# Altium schematic sheet CPU PHY.SchDoc: CPU PHY
size A2; DrawnBy: UKAYACIK; Engineer: UKAYACIK; DocumentNumber: 5; Revision: B; SheetNumber: 6; SheetTotal: 21
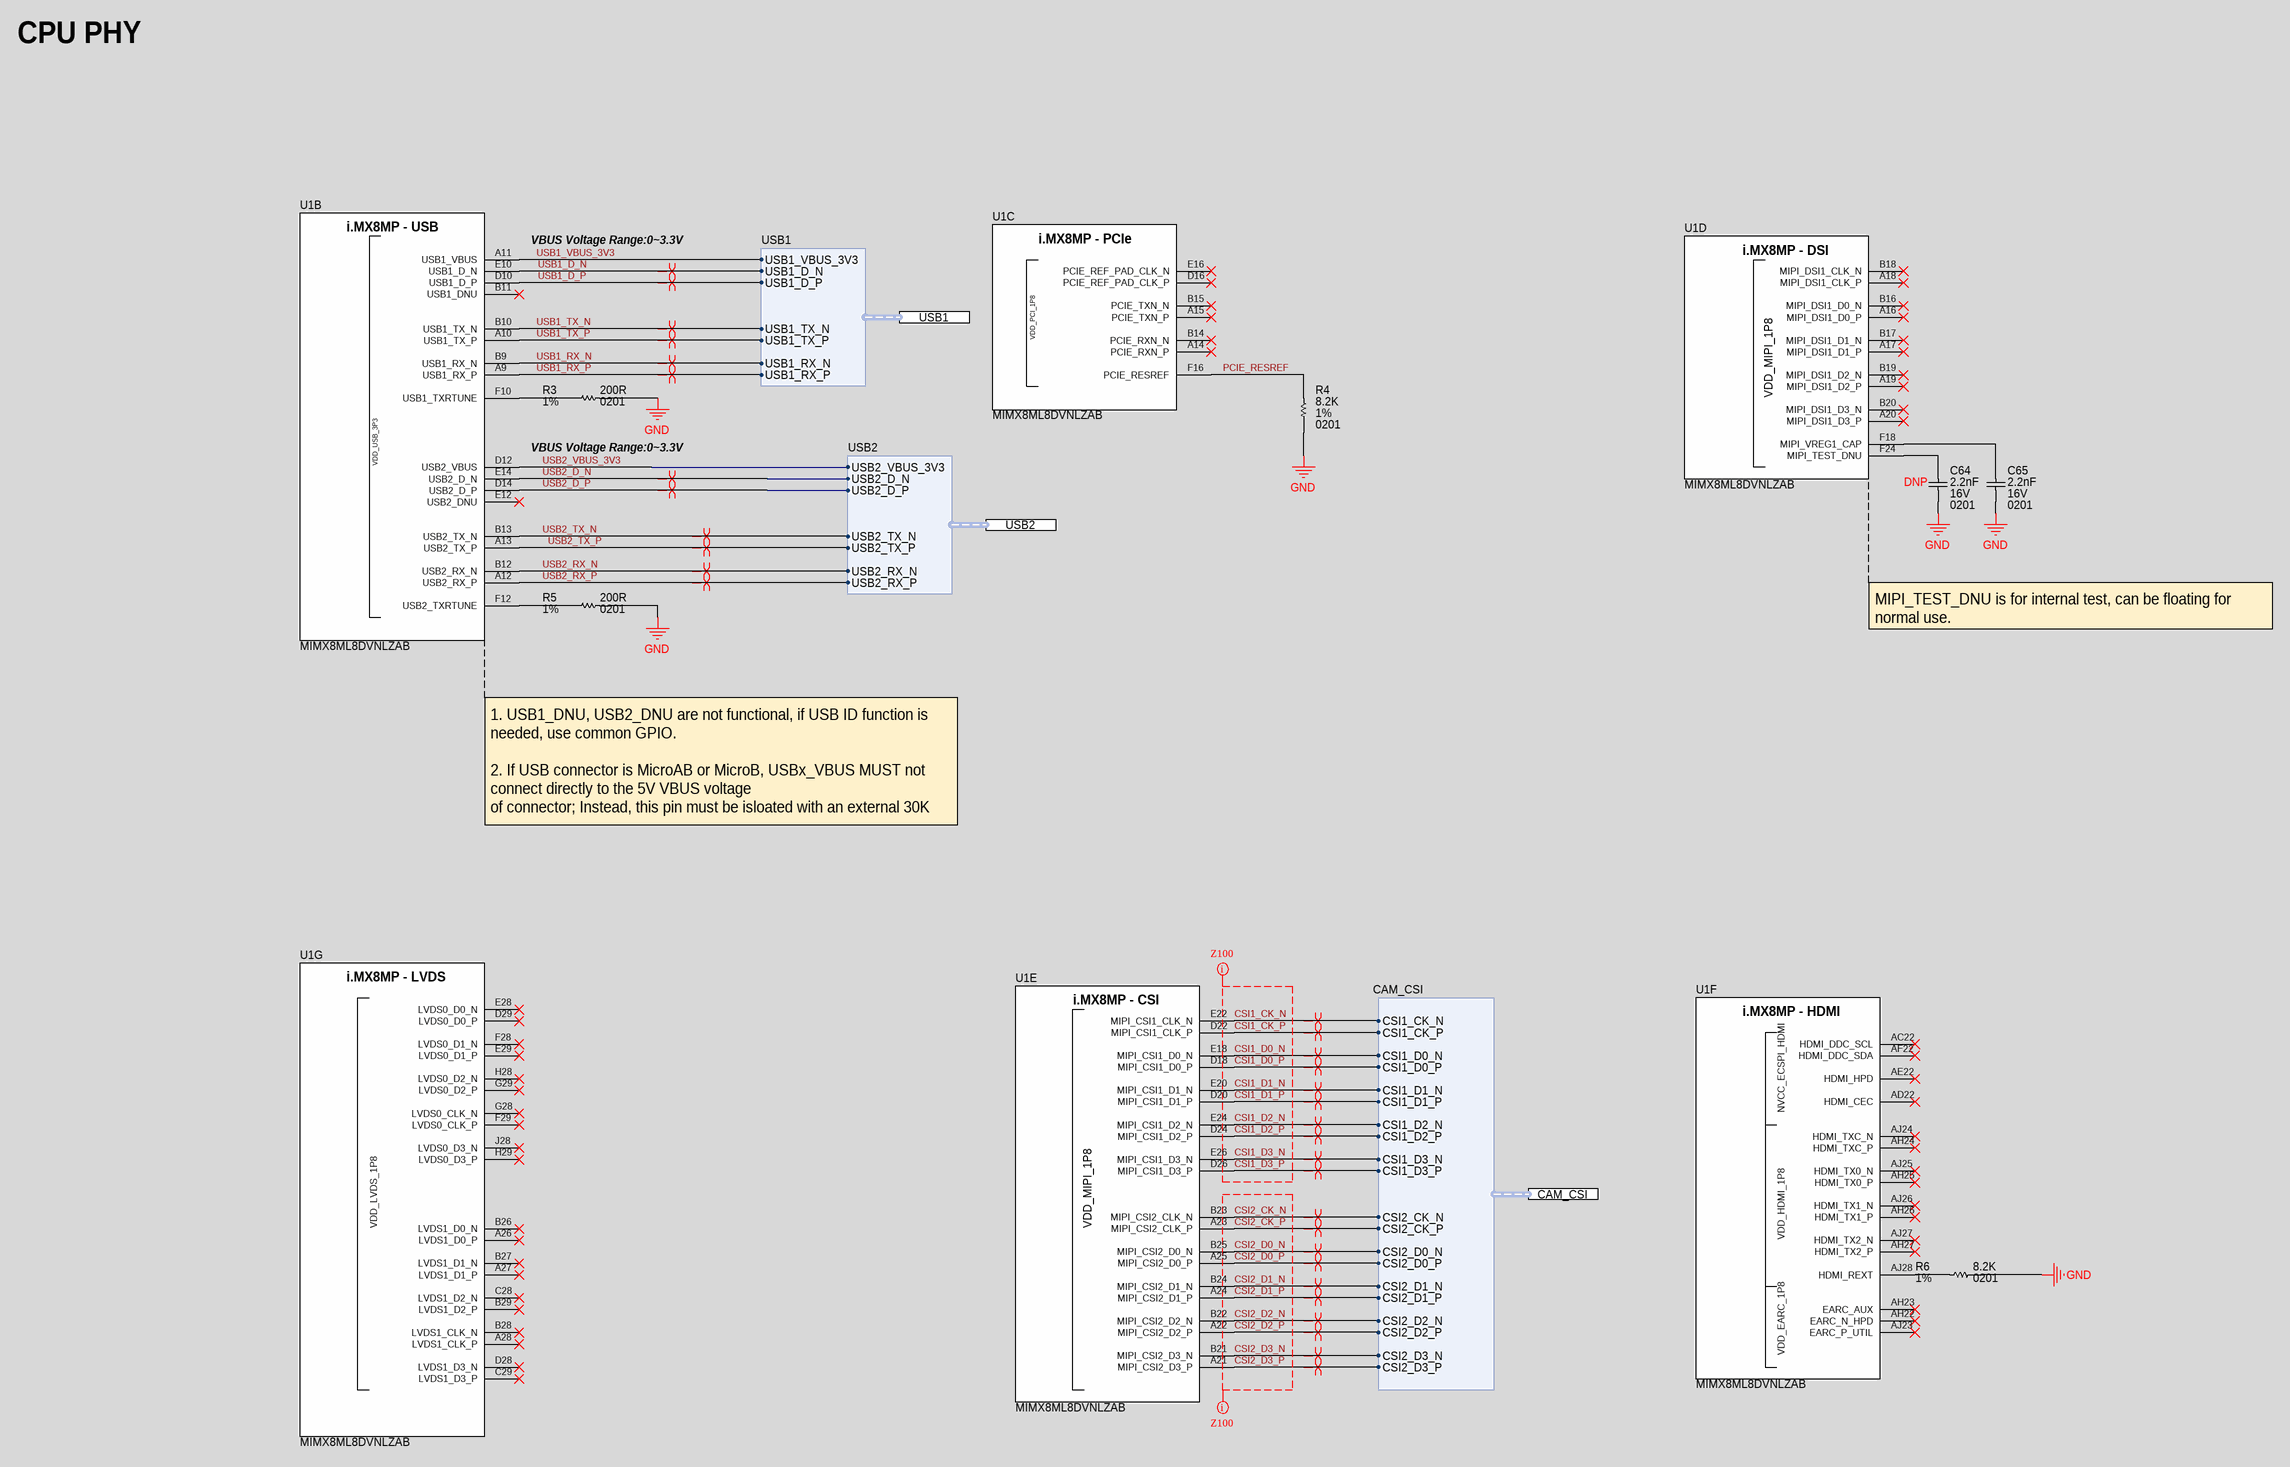
[diagram p0: CPU PHY.SchDoc]

## Parts
C64  Voltage Rating: 16V  Capacitance: 2.2nF  Case/Package: 0201  [CAP_0201_CAPC0603X03N]  (hidden comment: GRM033R71C222KA88D)
C65  Voltage Rating: 16V  Capacitance: 2.2nF  Case/Package: 0201  [CAP_0201_CAPC0603X03N]  (hidden comment: GRM033R71C222KA88D)
R3  Tolerance: 1%  Resistance: 200R  Case/Package: 0201  [RES_0201_RESC0603X02N]  (hidden comment: RC0201FR-07200RL)
R4  Tolerance: 1%  Resistance: 8.2K  Case/Package: 0201  [RES_0201_RESC0603X02N]  (hidden comment: RC0201FR-078K2L)
R5  Tolerance: 1%  Resistance: 200R  Case/Package: 0201  [RES_0201_RESC0603X02N]  (hidden comment: RC0201FR-07200RL)
R6  Tolerance: 1%  Resistance: 8.2K  Case/Package: 0201  [RES_0201_RESC0603X02N]  (hidden comment: RC0201FR-078K2L)
U1  MIMX8ML8DVNLZAB  [IC_MPU_BGA548C50P29X29_1500X1500X148]  (parts B,C,D,E,F,G of 15)

## Ports
CAM_CSI (harness CAM_CSI), USB1 (harness USB1), USB2 (harness USB2)

## Harnesses
USB1: USB1_VBUS_3V3, USB1_D_N, USB1_D_P, USB1_TX_N, USB1_TX_P, USB1_RX_N, USB1_RX_P
CAM_CSI: CSI1_CK_N, CSI1_CK_P, CSI1_D0_N, CSI1_D0_P, CSI1_D1_N, CSI1_D1_P, CSI1_D2_N, CSI1_D2_P, CSI1_D3_N, CSI1_D3_P, CSI2_CK_N, CSI2_CK_P, CSI2_D0_N, CSI2_D0_P, CSI2_D1_N, CSI2_D1_P, CSI2_D2_N, CSI2_D2_P, CSI2_D3_N, CSI2_D3_P
USB2: USB2_VBUS_3V3, USB2_TX_N, USB2_TX_P, USB2_RX_N, USB2_RX_P, USB2_D_N, USB2_D_P

## Nets
GND: C64.1 C65.1 R3.2 R4.1 R5.2 R6.1
CSI1_CK_N: U1.E22(MIPI_CSI1_CLK_N) ; port CAM_CSI.CSI1_CK_N
CSI1_CK_P: U1.D22(MIPI_CSI1_CLK_P) ; port CAM_CSI.CSI1_CK_P
CSI1_D0_N: U1.E18(MIPI_CSI1_D0_N) ; port CAM_CSI.CSI1_D0_N
CSI1_D0_P: U1.D18(MIPI_CSI1_D0_P) ; port CAM_CSI.CSI1_D0_P
CSI1_D1_N: U1.E20(MIPI_CSI1_D1_N) ; port CAM_CSI.CSI1_D1_N
CSI1_D1_P: U1.D20(MIPI_CSI1_D1_P) ; port CAM_CSI.CSI1_D1_P
CSI1_D2_N: U1.E24(MIPI_CSI1_D2_N) ; port CAM_CSI.CSI1_D2_N
CSI1_D2_P: U1.D24(MIPI_CSI1_D2_P) ; port CAM_CSI.CSI1_D2_P
CSI1_D3_N: U1.E26(MIPI_CSI1_D3_N) ; port CAM_CSI.CSI1_D3_N
CSI1_D3_P: U1.D26(MIPI_CSI1_D3_P) ; port CAM_CSI.CSI1_D3_P
CSI2_CK_N: U1.B23(MIPI_CSI2_CLK_N) ; port CAM_CSI.CSI2_CK_N
CSI2_CK_P: U1.A23(MIPI_CSI2_CLK_P) ; port CAM_CSI.CSI2_CK_P
CSI2_D0_N: U1.B25(MIPI_CSI2_D0_N) ; port CAM_CSI.CSI2_D0_N
CSI2_D0_P: U1.A25(MIPI_CSI2_D0_P) ; port CAM_CSI.CSI2_D0_P
CSI2_D1_N: U1.B24(MIPI_CSI2_D1_N) ; port CAM_CSI.CSI2_D1_N
CSI2_D1_P: U1.A24(MIPI_CSI2_D1_P) ; port CAM_CSI.CSI2_D1_P
CSI2_D2_N: U1.B22(MIPI_CSI2_D2_N) ; port CAM_CSI.CSI2_D2_N
CSI2_D2_P: U1.A22(MIPI_CSI2_D2_P) ; port CAM_CSI.CSI2_D2_P
CSI2_D3_N: U1.B21(MIPI_CSI2_D3_N) ; port CAM_CSI.CSI2_D3_N
CSI2_D3_P: U1.A21(MIPI_CSI2_D3_P) ; port CAM_CSI.CSI2_D3_P
PCIE_RESREF: R4.2 U1.F16(PCIE_RESREF)
USB1_D_N: U1.E10(USB1_D_N) ; port USB1.USB1_D_N
USB1_D_P: U1.D10(USB1_D_P) ; port USB1.USB1_D_P
USB1_RX_N: U1.B9(USB1_RX_N) ; port USB1.USB1_RX_N
USB1_RX_P: U1.A9(USB1_RX_P) ; port USB1.USB1_RX_P
USB1_TX_N: U1.B10(USB1_TX_N) ; port USB1.USB1_TX_N
USB1_TX_P: U1.A10(USB1_TX_P) ; port USB1.USB1_TX_P
USB1_VBUS_3V3: U1.A11(USB1_VBUS) ; port USB1.USB1_VBUS_3V3
USB2_D_N: U1.E14(USB2_D_N) ; port USB2.USB2_D_N
USB2_D_P: U1.D14(USB2_D_P) ; port USB2.USB2_D_P
USB2_RX_N: U1.B12(USB2_RX_N) ; port USB2.USB2_RX_N
USB2_RX_P: U1.A12(USB2_RX_P) ; port USB2.USB2_RX_P
USB2_TX_N: U1.B13(USB2_TX_N) ; port USB2.USB2_TX_N
USB2_TX_P: U1.A13(USB2_TX_P) ; port USB2.USB2_TX_P
USB2_VBUS_3V3: U1.D12(USB2_VBUS) ; port USB2.USB2_VBUS_3V3
NetC64_2: C64.2 U1.F24(MIPI_TEST_DNU)
NetC65_2: C65.2 U1.F18(MIPI_VREG1_CAP)
NetR3_1: R3.1 U1.F10(USB1_TXRTUNE)
NetR5_1: R5.1 U1.F12(USB2_TXRTUNE)
NetR6_2: R6.2 U1.AJ28(HDMI_REXT)

Not connected (* = marked no-connect by the designer): U1 A14(PCIE_RXN_P)* A15(PCIE_TXN_P)* A16(MIPI_DSI1_D0_P)* A17(MIPI_DSI1_D1_P)* A18(MIPI_DSI1_CLK_P)* A19(MIPI_DSI1_D2_P)* A20(MIPI_DSI1_D3_P)* A26(LVDS1_D0_P)* A27(LVDS1_D1_P)* A28(LVDS1_CLK_P)* AC22(HDMI_DDC_SCL)* AD22(HDMI_CEC)* AE22(HDMI_HPD)* AF22(HDMI_DDC_SDA)* AH22(EARC_N_HPD)* AH23(EARC_AUX)* AH24(HDMI_TXC_P)* AH25(HDMI_TX0_P)* AH26(HDMI_TX1_P)* AH27(HDMI_TX2_P)* AJ23(EARC_P_UTIL)* AJ24(HDMI_TXC_N)* AJ25(HDMI_TX0_N)* AJ26(HDMI_TX1_N)* AJ27(HDMI_TX2_N)* B11(USB1_DNU)* B14(PCIE_RXN_N)* B15(PCIE_TXN_N)* B16(MIPI_DSI1_D0_N)* B17(MIPI_DSI1_D1_N)* B18(MIPI_DSI1_CLK_N)* B19(MIPI_DSI1_D2_N)* B20(MIPI_DSI1_D3_N)* B26(LVDS1_D0_N)* B27(LVDS1_D1_N)* B28(LVDS1_CLK_N)* B29(LVDS1_D2_P)* C28(LVDS1_D2_N)* C29(LVDS1_D3_P)* D16(PCIE_REF_PAD_CLK_P)* D28(LVDS1_D3_N)* D29(LVDS0_D0_P)* E12(USB2_DNU)* E16(PCIE_REF_PAD_CLK_N)* E28(LVDS0_D0_N)* E29(LVDS0_D1_P)* F28(LVDS0_D1_N)* F29(LVDS0_CLK_P)* G28(LVDS0_CLK_N)* G29(LVDS0_D2_P)* H28(LVDS0_D2_N)* H29(LVDS0_D3_P)* J28(LVDS0_D3_N)*

## Layout directives
net class CSI1_Z100: CSI1_CK_N, CSI1_CK_P, CSI1_D0_N, CSI1_D0_P, CSI1_D1_N, CSI1_D1_P, CSI1_D2_N, CSI1_D2_P, CSI1_D3_N, CSI1_D3_P
net class CSI2_Z100: CSI2_CK_N, CSI2_CK_P, CSI2_D0_N, CSI2_D0_P, CSI2_D1_N, CSI2_D1_P, CSI2_D2_N, CSI2_D2_P, CSI2_D3_N, CSI2_D3_P
differential pair; differential pair class Z100: CSI1_CK_N, CSI1_CK_P, CSI1_D0_N, CSI1_D0_P, CSI1_D1_N, CSI1_D1_P, CSI1_D2_N, CSI1_D2_P, CSI1_D3_N, CSI1_D3_P, CSI2_CK_N, CSI2_CK_P, CSI2_D0_N, CSI2_D0_P, CSI2_D1_N, CSI2_D1_P, CSI2_D2_N, CSI2_D2_P, CSI2_D3_N, CSI2_D3_P
differential pair; differential pair class Z90: USB1_D_N, USB1_D_P, USB1_RX_N, USB1_RX_P, USB1_TX_N, USB1_TX_P, USB2_D_N, USB2_D_P, USB2_RX_N, USB2_RX_P, USB2_TX_N, USB2_TX_P

## Notes on the sheet
- CPU PHY
- VBUS Voltage Range:0~3.3V
- (near C64) DNP
- MIPI_TEST_DNU is for internal test, can be floating for normal use.
- 1. USB1_DNU, USB2_DNU are not functional, if USB ID function is needed, use common GPIO.
  2. If USB connector is MicroAB or MicroB, USBx_VBUS MUST not connect directly to the 5V VBUS voltage
  of connector; Instead, this pin must be isloated with an external 30K 1% resistor.
- PCB Des :
- Approv By :
- Project Title :
- Sheet Title :
- Date :
- Page :
- PCB Version :
- PCB Revision :
- Size :
- A2
- (in symbol IC_MPU_8M_PLUS_MIMX8ML8DVNLZAB, part B) i.MX8MP - USB
- (in symbol IC_MPU_8M_PLUS_MIMX8ML8DVNLZAB, part C) i.MX8MP - PCIe
- (in symbol IC_MPU_8M_PLUS_MIMX8ML8DVNLZAB, part D) i.MX8MP - DSI
- (in symbol IC_MPU_8M_PLUS_MIMX8ML8DVNLZAB, part E) i.MX8MP - CSI
- (in symbol IC_MPU_8M_PLUS_MIMX8ML8DVNLZAB, part F) i.MX8MP - HDMI
- (in symbol IC_MPU_8M_PLUS_MIMX8ML8DVNLZAB, part G) i.MX8MP - LVDS

## Library data of the parts
C64 C65 = CAP_2200pF_16V_X7R_0201: Multilayer Ceramic Capacitor, 2200 pF, 16 V, ± 10%, X7R, 0201 [0603 Metric]; Manufacturer: Murata; Supplier 1: Digikey; Manufacturer Part Number: GRM033R71C222KA88D; RoHS: Yes; Category: Ceramic Capacitors; Stock 1: 653022; Pricing 1: 1=0.1, 10=0.01, 50=0.0056, 100=0.0043, 500=0.00324, 1000=0.00255, 2500=0.00232, 5000=0.00213 (USD); Mount: Surface Mount; Case Code (Metric): 0603; Case Code (Imperial): 0201; Material: Ceramic; Min Operating Temperature: -55°C; Max Operating Temperature: 125°C; Package Quantity: 1; Tolerance: 10%; Packaging: Tape and Reel; Voltage Rating (DC): 16V; Dielectric: X7R; Termination: SMD/SMT; Voltage: 16V; Series: GRM; Construction: Flat; Length: 0.6mm; Width: 0.012inch; Height: 0.3mm; Thickness: 0.013inch; Depth: 0.3mm; Radiation Hardening: No; Reach SVHC Compliant: No; Lead Free: Lead Free; RoHS Compliant: Yes; ComponentLink1URL: https://datasheet.ciiva.com/130/grm033r71c222ka88-01-130159.pdf?src-supplier=Digikey; ComponentLink1Description: https://datasheet.ciiva.com/130/grm033r71c222ka88-01-130159.pdf?src-supplier=Digikey; ComponentLink2URL: https://datasheet.ciiva.com/130/grm033r71c222ka88-01-130158.pdf?src-supplier=Digikey; ComponentLink2Description: https://datasheet.ciiva.com/130/grm033r71c222ka88-01-130158.pdf?src-supplier=Digikey; ComponentLink3URL: https://datasheet.ciiva.com/130/product-130160.pdf?src-supplier=Digikey; ComponentLink3Description: https://datasheet.ciiva.com/130/product-130160.pdf?src-supplier=Digikey; ComponentLink4URL: https://datasheet.ciiva.com/18184/getdatasheetpartid-153132-18184090.pdf?src-supplier=Verical; ComponentLink4Description: https://datasheet.ciiva.com/18184/getdatasheetpartid-153132-18184090.pdf?src-supplier=Verical; ComponentLink5URL: https://datasheet.ciiva.com/29199/455766-da-01-en-vs-kondensator-0201-29199161.pdf?src-supplier=Conrad; ComponentLink5Description: https://datasheet.ciiva.com/29199/455766-da-01-en-vs-kondensator-0201-29199161.pdf?src-supplier=Conrad; ComponentLink6URL: https://datasheet.ciiva.com/11620/product-11620555.pdf?src-supplier=Avnet; ComponentLink6Description: https://datasheet.ciiva.com/11620/product-11620555.pdf?src-supplier=Avnet; Supplier Part Number 1: 490-3190-1-ND
R3 R5 = RES_200R_1%_50mW_0201: SMD Chip Resistor, 200 Ohm, ± 1%, 50 mW, 0201 [0603 Metric], Thick Film, General Purpose; Manufacturer: Yageo; Voltage Rating: 25V; Power Rating: 50mW; Temperature Coefficient: 200ppm/°C; Supplier 1: Mouser; Manufacturer Part Number: RC0201FR-07200RL; RoHS: Yes; Category: Chip SMD Resistors; Stock 1: 289096; Pricing 1: 1=0.1, 10=0.015, 50=0.015, 100=0.008, 1000=0.006, 10000=0.006 (USD); Case Code (Imperial): 0201; Case Code (Metric): 0603; Size Code: 0201; Min Operating Temperature: -55°C; Max Operating Temperature: 125°C; Package Quantity: 10000; Packaging: Tape and Reel; Termination: SMD/SMT; Number of Terminations: 2; Max Power Dissipation: 50mW; Features: Moisture Resistant; Series: RC; Length: 0.6mm; Width: 0.3mm; Height: 0.23mm; Lead Free: Lead Free; RoHS Compliant: Yes; ComponentLink1URL: http://www.mouser.com/ds/2/447/RC0201-559633.pdf?src-supplier=Mouser; ComponentLink1Description: http://www.mouser.com/ds/2/447/RC0201-559633.pdf?src-supplier=Mouser; ComponentLink2URL: https://datasheet.octopart.com/RC0201FR-07200RL-Yageo-datasheet-164759695.pdf?src-supplier=Future+Electronics; ComponentLink2Description: https://datasheet.octopart.com/RC0201FR-07200RL-Yageo-datasheet-164759695.pdf?src-supplier=Future+Electronics; ComponentLink3URL: http://www.yageo.com/documents/recent/PYu-RC0201_51_RoHS_L_(8).pdf?src-supplier=Future+Electronics; ComponentLink3Description: http://www.yageo.com/documents/recent/PYu-RC0201_51_RoHS_L_(8).pdf?src-supplier=Future+Electronics; ComponentLink4URL: http://www.yageo.com/documents/recent/PYu-RC_Group_51_RoHS_L_10.pdf?src-supplier=Digikey; ComponentLink4Description: http://www.yageo.com/documents/recent/PYu-RC_Group_51_RoHS_L_10.pdf?src-supplier=Digikey; ComponentLink5URL: http://www.yageo.com/documents/recent/PYu-RC_Group_51_RoHS_L_9.pdf?src-supplier=Digikey; ComponentLink5Description: http://www.yageo.com/documents/recent/PYu-RC_Group_51_RoHS_L_9.pdf?src-supplier=Digikey; Supplier Part Number 1: 603-RC0201FR-07200RL
R4 R6 = RES_8.2K_1%_50mW_0201: Res Thick Film 0201 8.2K Ohm 1% 1/20W ±200ppm/°C Molded SMD Paper T/R; Manufacturer: Yageo; Power Rating: 50mW; Voltage Rating: 25V; Supplier 1: Digikey; Manufacturer Part Number: RC0201FR-078K2L; RoHS: Yes; Category: Chip SMD Resistors; Stock 1: 120132; Pricing 1: 1=0.1, 10=0.027, 50=0.0172, 100=0.0143, 500=0.00988, 1000=0.00854, 5000=0.00629 (USD); Case Code (Metric): 0603; Case Code (Imperial): 0201; Min Operating Temperature: -55°C; Max Operating Temperature: 125°C; Package Quantity: 10000; Packaging: Tape and Reel; Resistor Type: Thick Film; Number of Terminations: 2; Termination: SMD/SMT; Max Power Dissipation: 50mW; Temperature Coefficient: 200ppm/°C; Features: Moisture Resistant; Series: RC; Resistance Tolerance: 1%; Length: 0.024inch; Width: 0.3mm; Height: 0.01inch; Reach SVHC Compliant: No; Lead Free: Lead Free; RoHS Compliant: Yes; ComponentLink1URL: https://datasheet.ciiva.com/14985/pyu-r-int-thick-7-14985436.pdf?src-supplier=Digikey; ComponentLink1Description: https://datasheet.ciiva.com/14985/pyu-r-int-thick-7-14985436.pdf?src-supplier=Digikey; Supplier Part Number 1: YAG2353CT-ND
U1 = IC_MPU_8M_PLUS_MIMX8ML8DVNLZAB: i.MX 8M Plus, Consumer, / TRAY TRAY MULTIPLE DP BAKEABLE RoHS Compliant: Yes; Manufacturer: NXP Semiconductors; Supplier 1: Arrow Electronics; Manufacturer Part Number: MIMX8ML8DVNLZAB; RoHS: Yes; Category: Microprocessors; Stock 1: 1036; Pricing 1: 1=54.8, 5=52.24, 10=44.19, 25=42.8, 50=39.95, 100=31.83 (USD); Supplier Part Number 1: MIMX8ML8DVNLZAB